# EAGLE design fenrir (EAGLE 9.6.2)
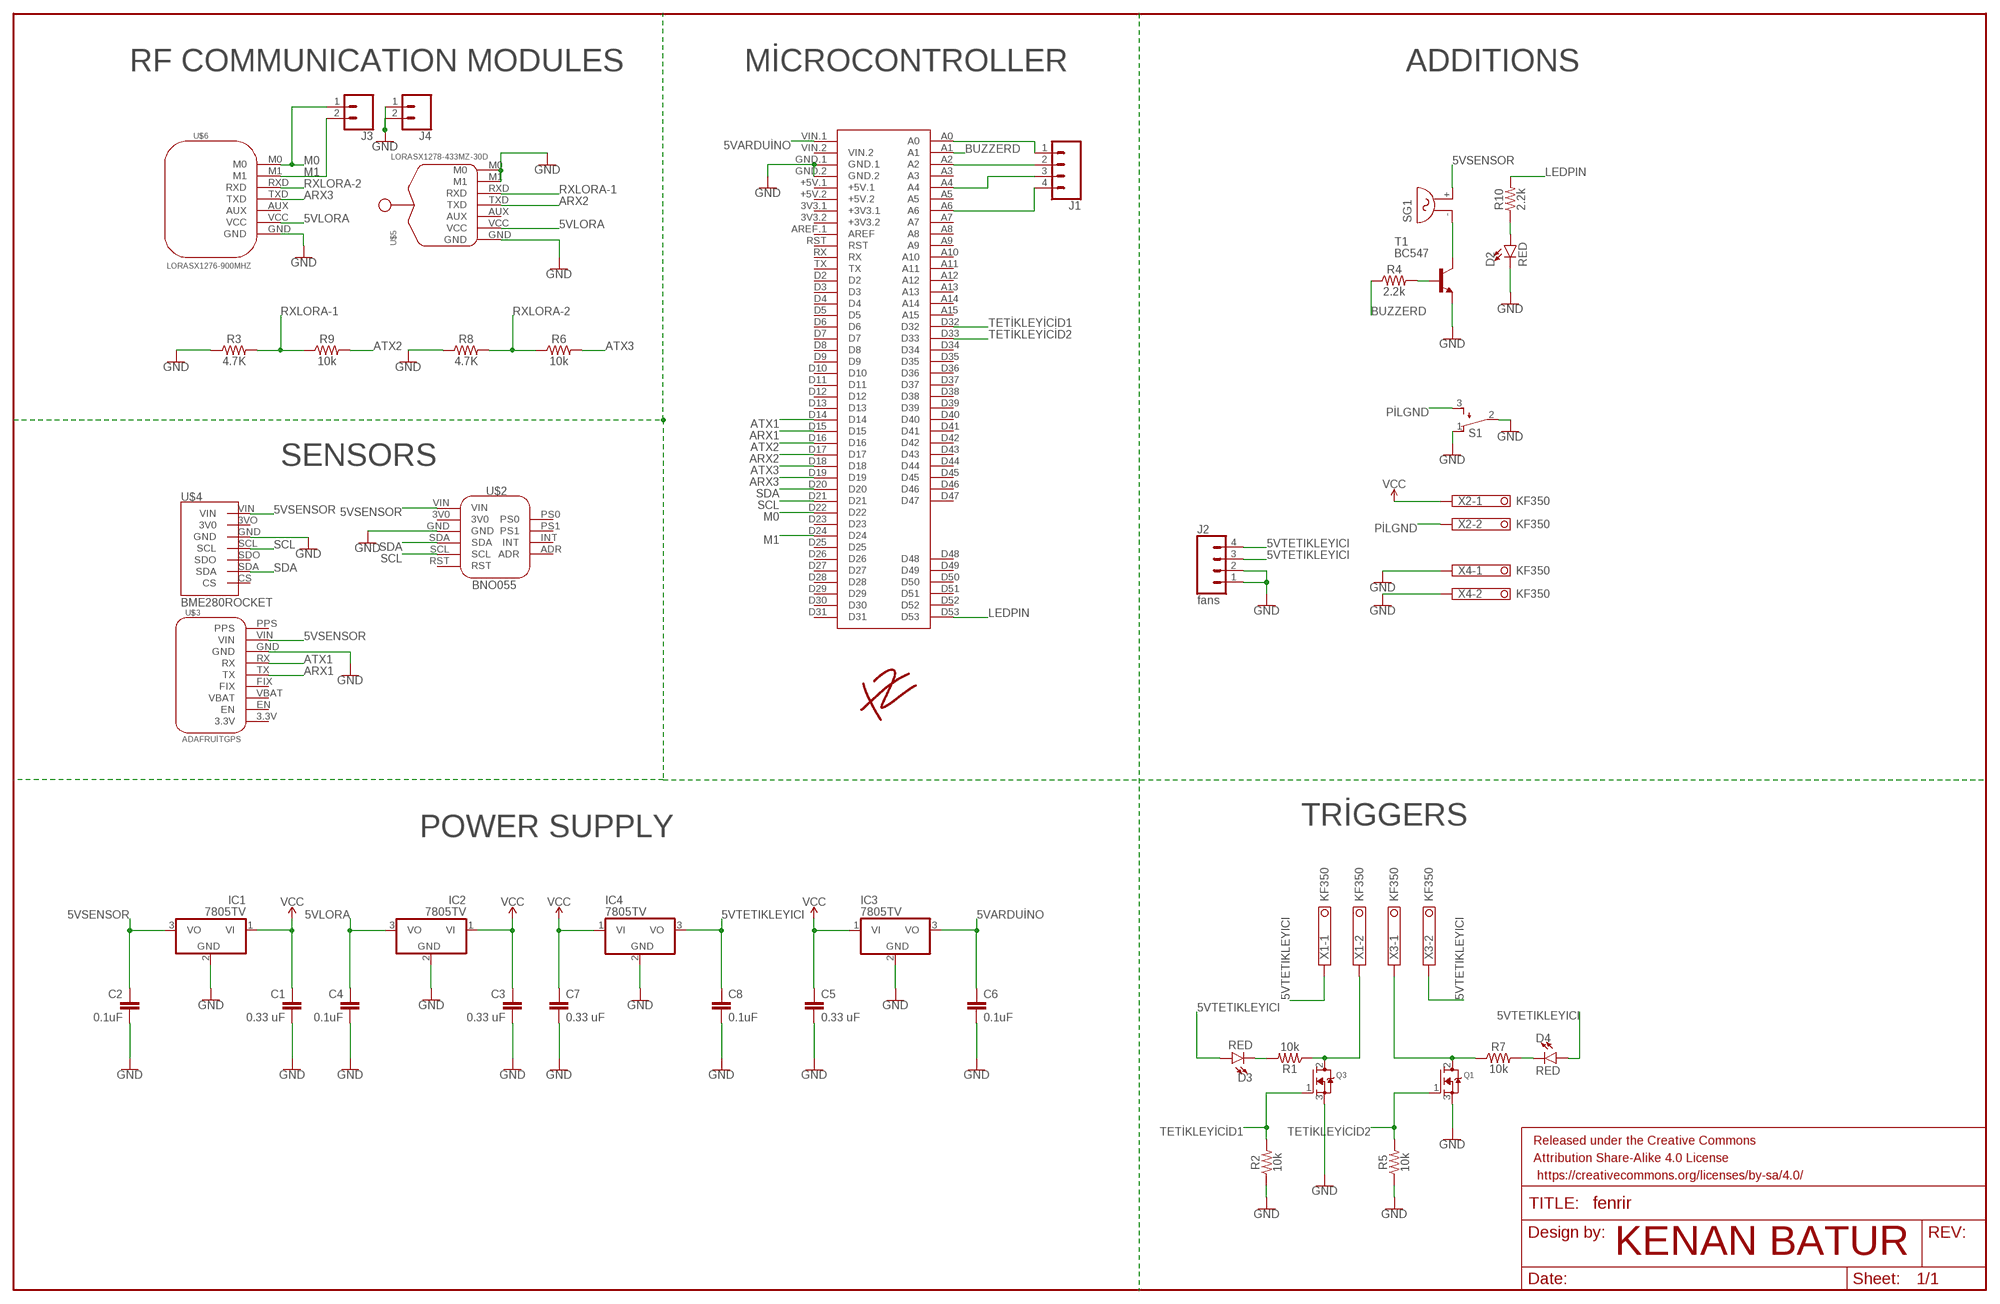
[diagram p0: schematic, sheet 1]

## Parts
C1  0.33 uF  C2,5-3  [C2.5-3]
C2  0.1uF  C2,5-3  [C2.5-3]
C3  0.33 uF  C2,5-3  [C2.5-3]
C4  0.1uF  C2,5-3  [C2.5-3]
C5  0.33 uF  C2,5-3  [C2.5-3]
C6  0.1uF  C2,5-3  [C2.5-3]
C7  0.33 uF  C2,5-3  [C2.5-3]
C8  0.1uF  C2,5-3  [C2.5-3]
D2  RED  LED-RED1206  [LED-1206]
D3  RED  LED-RED1206  [LED-1206]
D4  RED  LED-RED1206  [LED-1206]
FRAME2  FRAME-LEDGER  [CREATIVE_COMMONS]
IC1  7805TV  [TO220V]
IC2  7805TV  [TO220V]
IC3  7805TV  [TO220V]
IC4  7805TV  [TO220V]
J1  CONN_04  [1X04]
J2  fans  CONN_04  [1X04]
J3  CONN_02  [1X02]
J4  CONN_02  [1X02]
Q1  MOSFET-NGDS_TO220V  [TO220V]
Q3  MOSFET-NGDS_TO220V  [TO220V]
R1  10k  10KOHM-HORIZ-1/4W-1%  [AXIAL-0.3]
R2  10k  10KOHM-HORIZ-1/4W-1%  [AXIAL-0.3]
R3  4.7K  10KOHM-HORIZ-1/4W-5%  [AXIAL-0.3]
R4  2.2k  10KOHM-HORIZ-1/4W-1%  [AXIAL-0.3]
R5  10k  10KOHM-HORIZ-1/4W-1%  [AXIAL-0.3]
R6  10k  10KOHM-HORIZ-1/4W-5%  [AXIAL-0.3]
R7  10k  10KOHM-HORIZ-1/4W-1%  [AXIAL-0.3]
R8  4.7K  10KOHM-HORIZ-1/4W-5%  [AXIAL-0.3]
R9  10k  10KOHM-HORIZ-1/4W-5%  [AXIAL-0.3]
R10  2.2k  10KOHM-HORIZ-1/4W-1%  [AXIAL-0.3]
S1  TL32PO  [TL3XPO]
SG1  F/QMX  [F/QMX]
T1  BC547  [TO92]
U$1  MEGA2560_MIKRO  [MEGA2560_MIKRO]
U$2  BNO055  [BNO055]
U$3  ADAFRUİTGPS  [ADAFRUİTGPS]
U$4  BME280ROCKET  [BME280ROCKET]
U$5  LORASX1278-433MZ-30D  [LORASX1278-433MHZ-30D]
U$6  LORASX1276-900MHZ  LORASX1278-433MHZ  [LORASX1278-433MHZ]
U$7  MAVİLOGO  [LOGOMAVİ]
X1  KF350  TERMINAL-BLOCK-3.5MM-2-PIN-ROUND-PAD  [TERMINAL-BLOCK-2-PIN-3.5MM-ROUND-PAD]
X2  KF350  TERMINAL-BLOCK-3.5MM-2-PIN-ROUND-PAD  [TERMINAL-BLOCK-2-PIN-3.5MM-ROUND-PAD]
X3  KF350  TERMINAL-BLOCK-3.5MM-2-PIN-ROUND-PAD  [TERMINAL-BLOCK-2-PIN-3.5MM-ROUND-PAD]
X4  KF350  TERMINAL-BLOCK-3.5MM-2-PIN-ROUND-PAD  [TERMINAL-BLOCK-2-PIN-3.5MM-ROUND-PAD]

## Nets
5VARDUİNO: C6.1 IC3.3(VO) U$1.VIN.1
5VLORA: C4.1 IC2.3(VO) U$5.VCC U$6.VCC
5VSENSOR: C2.1 IC1.3(VO) SG1.+ U$2.VIN U$3.VIN U$4.VIN
5VTETIKLEYICI: C8.1 D3.A D4.A IC4.3(VO) J2.3 J2.4 X1.1 X3.2
ARX1: U$1.D15 U$3.TX
ARX2: U$1.D17 U$5.TXD
ARX3: U$1.D19 U$6.TXD
ATX1: U$1.D14 U$3.RX
ATX2: R9.P$2 U$1.D16
ATX3: R6.P$2 U$1.D18
BUZZERD: R4.P$1 U$1.A1
GND: C1.2 C2.2 C3.2 C4.2 C5.2 C6.2 C7.2 C8.2 D2.C IC1.2(GND) IC2.2(GND) IC3.2(GND) IC4.2(GND) J2.1 J2.2 J4.1 J4.2 Q1.3(S) Q3.3(S) R2.P$1 R3.P$1 R5.P$1 R8.P$1 S1.1(O) S1.2(P) T1.1(E) U$1.GND.1 U$1.GND.2 U$2.GND U$3.GND U$4.GND U$5.GND U$5.M0 U$5.M1 U$6.GND X4.1 X4.2
LEDPIN: R10.P$2 U$1.D53
M0: J3.1 U$1.D22 U$6.M0
M1: J3.2 U$1.D24 U$6.M1
N$1: Q3.2(D) R1.P$1 X1.2
N$2: SG1.- T1.3(C)
N$3: J1.1 U$1.A0
N$4: D3.C R1.P$2
N$5: D4.C R7.P$2
N$6: Q1.2(D) R7.P$1 X3.1
N$7: R4.P$2 T1.2(B)
N$8: J1.2 U$1.A2
N$9: J1.3 U$1.A4
N$10: J1.4 U$1.A6
N$11: D2.A R10.P$1
PİLGND: S1.3(S) X2.2
RXLORA-1: R3.P$2 R9.P$1 U$5.RXD
RXLORA-2: R6.P$1 R8.P$2 U$6.RXD
SCL: U$1.D21 U$2.SCL U$4.SCL
SDA: U$1.D20 U$2.SDA U$4.SDA
TETİKLEYİCİD1: Q3.1(G) R2.P$2 U$1.D32
TETİKLEYİCİD2: Q1.1(G) R5.P$2 U$1.D33
VCC: C1.1 C3.1 C5.1 C7.1 IC1.1(VI) IC2.1(VI) IC3.1(VI) IC4.1(VI) X2.1
Unconnected: U$1.3V3.1(+3V3.1) U$1.3V3.2(+3V3.2) U$1.+5V.1 U$1.+5V.2 U$1.A3 U$1.A5 U$1.A7 U$1.A8 U$1.A9 U$1.A10 U$1.A11 U$1.A12 U$1.A13 U$1.A14 U$1.A15 U$1.AREF.1(AREF) U$1.D2 U$1.D3 U$1.D4 U$1.D5 U$1.D6 U$1.D7 U$1.D8 U$1.D9 U$1.D10 U$1.D11 U$1.D12 U$1.D13 U$1.D23 U$1.D25 U$1.D26 U$1.D27 U$1.D28 U$1.D29 U$1.D30 U$1.D31 U$1.D34 U$1.D35 U$1.D36 U$1.D37 U$1.D38 U$1.D39 U$1.D40 U$1.D41 U$1.D42 U$1.D43 U$1.D44 U$1.D45 U$1.D46 U$1.D47 U$1.D48 U$1.D49 U$1.D50 U$1.D51 U$1.D52 U$1.RST U$1.RX U$1.TX U$1.VIN.2 U$2.3V0 U$2.ADR U$2.INT U$2.PS0 U$2.PS1 U$2.RST U$3.3.3V U$3.EN U$3.FIX U$3.PPS U$3.VBAT U$4.3VO(3V0) U$4.CS U$4.SDO U$5.AUX U$6.AUX

## Notes on the sheet
- RF COMMUNICATION MODULES | MİCROCONTROLLER | ADDITIONS
- SENSORS
- TRİGGERS
- POWER SUPPLY
- KENAN BATUR

## Library data of the parts
C1-C8 = capacitor-wima:C: CAPACITOR naming: grid - package width
D2-D4 = SparkFun-LED:LED-RED: Red SMD LED Used in manufacturing of most products at SparkFun Packages: 0603 - SMD 0603 package [Product Link] <http://docs.avagotech.com/docs/AV02-0551EN> 0603 SMART - SMD 0603 SMART package ( more efficient and expensive)[Product Link] <http://www.osram-os.com/Graphics/XPic2/00077099_0.pdf> 1206 - SMD1206 package [Product Link] <https://www.sparkfun.com/datasheets/DevTools/LilyPad/Q150OVS4.pdff> SparkFun Products: Pro Mini 328 -5V <https://www.sparkfun.com/products/821> RedBoard <https://www.sparkfun.com/products/12757> IOIO-OTG <https://www.sparkfun.com/products/13613>; PROD_ID: DIO-09912
FRAME2 = SparkFun-Aesthetics:FRAME-LEDGER: Schematic Frame - Ledger Standard 11x14 US Ledger frame; DESIGN: asd
IC1-IC4 = linear:78*: Positive VOLTAGE REGULATOR Source: http://cache.national.com/ds/LM/LM78L05.pdf http://www.fairchildsemi.com/ds/LM/LM7805.pdf
J1 J2 = SparkFun-Connectors:CONN_04: Multi connection point. Often used as Generic Header-pin footprint for 0.1 inch spaced/style header connections On any of the 0.1 inch spaced packages, you can populate with these: Break Away Headers - Straight <https://www.sparkfun.com/products/116> (PRT-00116) Break Away Male Headers - Right Angle <https://www.sparkfun.com/products/553> (PRT-00553) Female Headers <https://www.sparkfun.com/products/115> (PRT-00115) Break Away Headers - Machine Pin <https://www.sparkfun.com/products/117> (PRT-00117) Break Away Female Headers - Swiss Machine Pin <https://www.sparkfun.com/products/743> (PRT-00743) For SCREWTERMINALS and SPRING TERMINALS visit here: Screw Terimnals on SparkFun.com <https://www.sparkfun.com/search/results?term=Screw+Terminals> (5mm/3.5mm/2.54mm spacing) This device is also useful as a general connection point to wire up your design to another part of your project. Our various solder wires solder well into these plated through hole pads. Hook-Up Wire - Assortment (Stranded, 22 AWG) <https://www.sparkfun.com/products/11375> (PRT-11375) Hook-Up Wire - Assortment (Solid Core, 22 AWG) <https://www.sparkfun.com/products/11367> (PRT-11367) View the entire wire category on our website here <https://www.sparkfun.com/categories/141> Special notes: Molex polarized connector foot print use with SKU : PRT-08231 with associated crimp pins and housings. 1MM SMD Version SKU: PRT-10208; PROD_ID: CONN-09696
J3 J4 = SparkFun-Connectors:CONN_02: Multi connection point. Often used as Generic Header-pin footprint for 0.1 inch spaced/style header connections On any of the 0.1 inch spaced packages, you can populate with these: Break Away Headers - Straight <https://www.sparkfun.com/products/116> (PRT-00116) Break Away Male Headers - Right Angle <https://www.sparkfun.com/products/553> (PRT-00553) Female Headers <https://www.sparkfun.com/products/115> (PRT-00115) Break Away Headers - Machine Pin <https://www.sparkfun.com/products/117> (PRT-00117) Break Away Female Headers - Swiss Machine Pin <https://www.sparkfun.com/products/743> (PRT-00743) For SCREWTERMINALS and SPRING TERMINALS visit here: Screw Terimnals on SparkFun.com <https://www.sparkfun.com/search/results?term=Screw+Terminals> (5mm/3.5mm/2.54mm spacing) This device is also useful as a general connection point to wire up your design to another part of your project. Our various solder wires solder well into these plated through hole pads. Hook-Up Wire - Assortment (Stranded, 22 AWG) <https://www.sparkfun.com/products/11375> (PRT-11375) Hook-Up Wire - Assortment (Solid Core, 22 AWG) <https://www.sparkfun.com/products/11367> (PRT-11367) View the entire wire category on our website here <https://www.sparkfun.com/categories/141> Special notes: Molex polarized connector foot print use with: PRT-08233 with associated crimp pins and housings. 2.54_SCREWTERM for use with PRT-10571. 3.5mm Screw Terminal footprints for PRT-08084 5mm Screw Terminal footprints for use with PRT-08432
Q1 Q3 = adafruit:MOSFET-N: N-Channel Mosfet 2N7002E - 60V 260mA SOT23 [Digikey: 2N7002ET1GOSTR-ND] - REEL BSH103 - 30V 850mA SOT23 [Digikey: 568-5013-1-ND]
R1 R2 R5 R7 = SparkFun-Resistors:10KOHM: 10kΩ resistor A resistor is a passive two-terminal electrical component that implements electrical resistance as a circuit element. Resistors act to reduce current flow, and, at the same time, act to lower voltage levels within circuits. - Wikipedia; PROD_ID: RES-12183
R3 R8 = SparkFun-Resistors:10KOHM: 10kΩ resistor A resistor is a passive two-terminal electrical component that implements electrical resistance as a circuit element. Resistors act to reduce current flow, and, at the same time, act to lower voltage levels within circuits. - Wikipedia; PROD_ID: RES-09435; VALUE: 10k
R4 R10 = SparkFun-Resistors:10KOHM: 10kΩ resistor A resistor is a passive two-terminal electrical component that implements electrical resistance as a circuit element. Resistors act to reduce current flow, and, at the same time, act to lower voltage levels within circuits. - Wikipedia; PROD_ID: RES-12183; VALUE: 10k
R6 R9 = SparkFun-Resistors:10KOHM: 10kΩ resistor A resistor is a passive two-terminal electrical component that implements electrical resistance as a circuit element. Resistors act to reduce current flow, and, at the same time, act to lower voltage levels within circuits. - Wikipedia; PROD_ID: RES-09435
S1 = switch:TL32PO: TINY SWITCH ON - MOM Source: http://www2.produktinfo.conrad.com/datenblaetter/700000-724999/705152-da-01-de-Subminiaturschalter_TL_36YO.pdf
SG1 = buzzer:F/QMX: BUZZER Source: Buerklin; OC_FARNELL: unknown; OC_NEWARK: unknown
T1 = transistor:BC547: NPN TRANSISTOR
U$1 = MIKRO_MEGA2560:MEGA2560_MIKRO: Arduino Mega2560 pro robotDyn, create by mikroavr.com
U$2 = BNO055:BNO055
U$3 = Adafruitgps:ADAFRUİTGPS
U$4 = BME280ROCKET:BME280ROCKET
U$5 = LORASX1278-433MHZ20D:LORASX1278-433MZ-30D
U$6 = LORASX1278-433MHZ20D:LORASX1278-433MHZ
U$7 = LOGO:MAVİLOGO
X1-X4 = Rembrandt Electronics - Terminal Block 3-5mm v1-0:TERMINAL-BLOCK-3.5MM-2-PIN: Terminal Block 3.5mm Pitch: 3,5 mm Number of pins: 2 Created by Rembrandt Electronics www.rembrandtelectronics.com

## Board
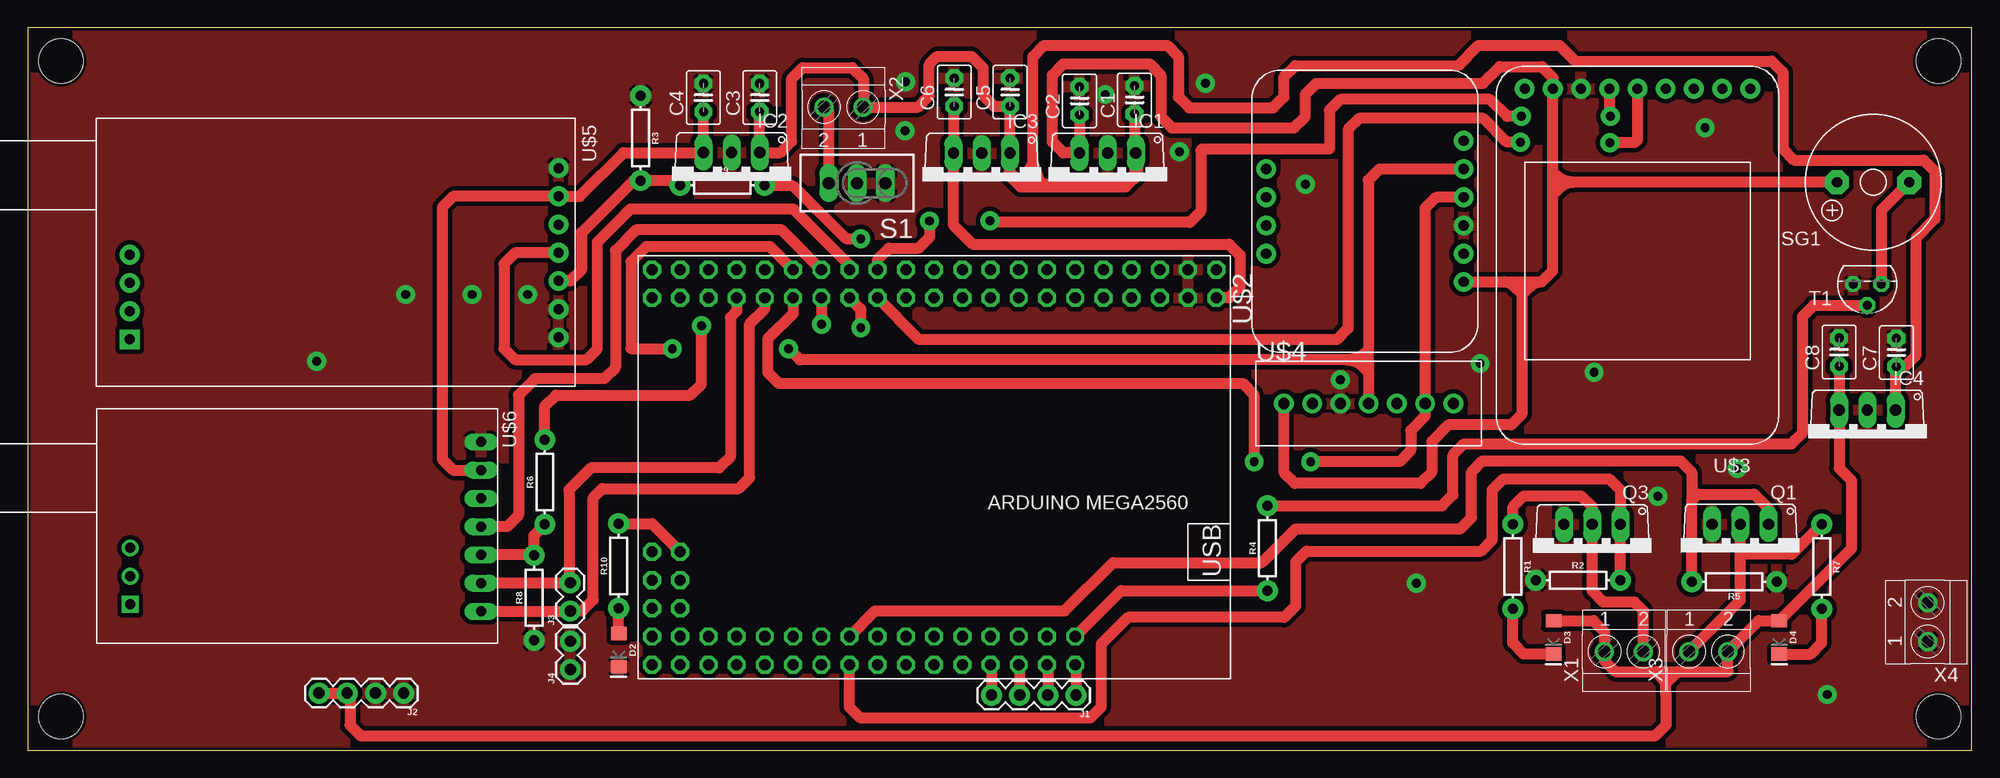
[diagram p1: board, top side]
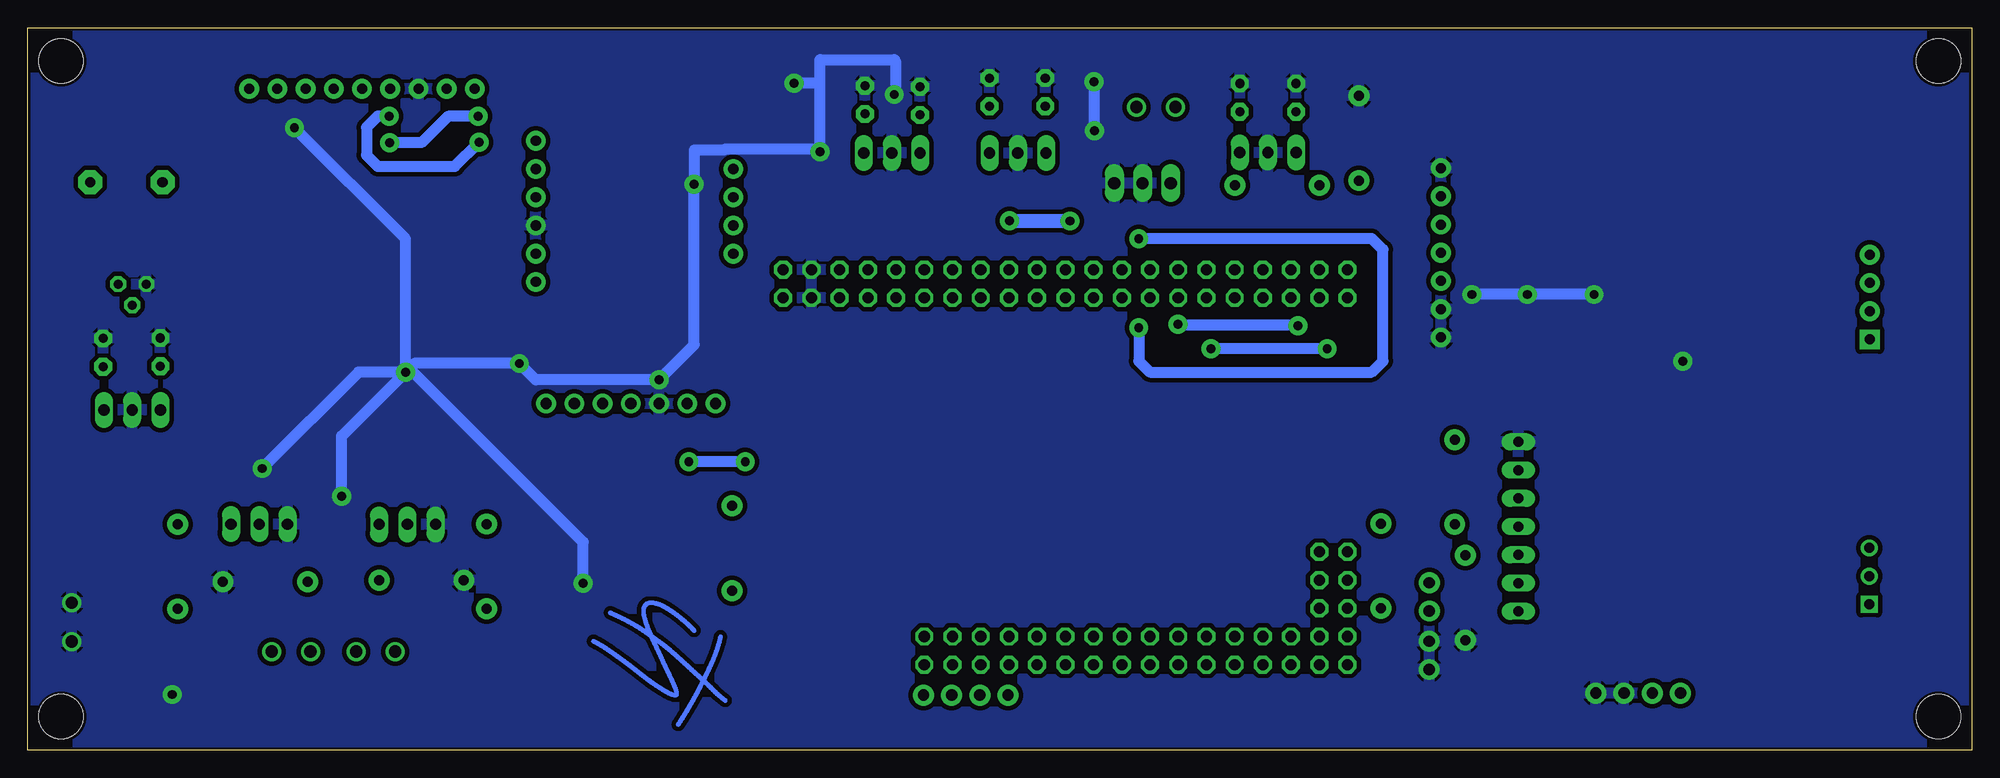
[diagram p2: board, bottom side, seen from below]

Size 175 x 65 mm. Coordinates in mm from the lower left corner, seen from the top.
Outline: 0,0 175,0 175,65 0,65 0,0
Copper layers (1*16): Top 0.035mm / dielectric 1.5mm / Bottom 0.035mm
Design rules "SparkFun *": minimum track width 8mil, minimum drill 20mil, track to track 16mil, track to pad 16mil, pad to pad 8mil, via to via 8mil, smd to smd 8mil, copper to edge 10mil, drill to drill 8mil, minimum pad ring 12mil, minimum via ring 10mil, stop-mask expansion 4mil, vias tented up to drill 25mil, thermal gap 10mil
Holes 4 mm at 3,62 3,3 172,62 172,3

### Footprints (pad centres in the part's own frame; a part is rotated, then mirrored left to right if it is on the bottom)
C2.5-3 = drill 0.813 pad 1.6 octagon: 1 -1.27,0; 2 1.27,0
LED-1206 = smd 1.2 x 1.4: A -1.5,0; C 1.5,0
TO220V = drill 1.016 long: 1 -2.54,-2.54; 2 0,-2.54; 3 2.54,-2.54
1X04 = drill 1.016 pad 1.88: 1 0,0; 2 2.54,0; 3 5.08,0; 4 7.62,0
1X02 = drill 1.016 pad 1.88: 1 0,0; 2 2.54,0
AXIAL-0.3 = drill 0.9 pad 1.88: P$1 -3.81,0; P$2 3.81,0
TL3XPO = drill 1.1 pad 1.422 long: 1 -2.54,0; 2 0,0; 3 2.54,0
F/QMX = drill 0.914 pad 2.159 octagon: + 3.251,0; - -3.251,0
TO92 = drill 0.813 octagon: 1 1.27,0; 2 0,1.905; 3 -1.27,0
MEGA2560_MIKRO = drill 1 octagon: 3V3.1 -26.67,-17.78; 3V3.2 -26.67,-20.32; +5V.1 -29.21,-17.78; +5V.2 -29.21,-20.32; A0 -21.59,15.24; A1 -21.59,12.7; A2 -19.05,15.24; A3 -19.05,12.7; A4 -16.51,15.24; A5 -16.51,12.7; A6 -13.97,15.24; A7 -13.97,12.7; A8 -11.43,15.24; A9 -11.43,12.7; A10 -8.89,15.24; A11 -8.89,12.7; A12 -6.35,15.24; A13 -6.35,12.7; A14 -3.81,15.24; A15 -3.81,12.7; AREF.1 -24.13,-17.78; D2 -19.05,-17.78; D3 -19.05,-20.32; D4 -16.51,-17.78; D5 -16.51,-20.32; D6 -13.97,-17.78; D7 -13.97,-20.32; D8 -11.43,-17.78; D9 -11.43,-20.32; D10 -8.89,-17.78; D11 -8.89,-20.32; D12 -6.35,-17.78; D13 -6.35,-20.32; D14 -3.81,-17.78; D15 -3.81,-20.32; D16 -1.27,-17.78; D17 -1.27,-20.32; D18 1.27,-17.78; D19 1.27,-20.32; D20 3.81,-17.78; D21 3.81,-20.32; D22 6.35,-17.78; D23 6.35,-20.32; D24 8.89,-17.78; D25 8.89,-20.32; D26 11.43,-17.78; D27 11.43,-20.32; D28 13.97,-17.78; D29 13.97,-20.32; D30 16.51,-17.78; D31 16.51,-20.32; D32 -1.27,15.24; D33 -1.27,12.7; D34 1.27,15.24; D35 1.27,12.7; D36 3.81,15.24; D37 3.81,12.7; D38 6.35,15.24; D39 6.35,12.7; D40 8.89,15.24; D41 8.89,12.7; D42 11.43,15.24; D43 11.43,12.7; D44 13.97,15.24; D45 13.97,12.7; D46 16.51,15.24; D47 16.51,12.7; D48 16.51,10.16; D49 13.97,10.16; D50 16.51,7.62; D51 13.97,7.62; D52 16.51,5.08; D53 13.97,5.08; GND.1 -31.75,-17.78; GND.2 -31.75,-20.32; RST -24.13,-20.32; RX -21.59,-17.78; TX -21.59,-20.32; VIN.1 -34.29,-17.78; VIN.2 -34.29,-20.32
BNO055 = drill 0.914 pad 1.778: 3V0 8.89,-19.05; ADR 16.51,-1.27; GND 11.43,-19.05; INT 13.97,-1.27; PS0 8.89,-1.27; PS1 11.43,-1.27; RST 19.05,-19.05; SCL 16.51,-19.05; SDA 13.97,-19.05; VIN 6.35,-19.05
ADAFRUİTGPS = drill 0.9 pad 1.778: 3.3V 2.54,-32.004; EN 5.08,-32.004; FIX 10.16,-32.004; GND 17.78,-32.004; PPS 22.86,-32.004; RX 15.24,-32.004; TX 12.7,-32.004; VBAT 7.62,-32.004; VIN 20.32,-32.004
BME280ROCKET = drill 1 pad 1.778: 3VO 2.54,0; CS 15.24,0; GND 5.08,0; SCL 7.62,0; SDA 12.7,0; SDO 10.16,0; VIN 0,0
LORASX1278-433MHZ-30D = drill 0.9 pad 1.778: AUX -2.475,2.31; GND -7.555,2.31; M0 7.685,2.31; M1 5.145,2.31; P$9 5.325,-36.29; P$10 2.785,-36.29; P$11 0.245,-36.29; RXD 2.605,2.31; TXD 0.065,2.31; VCC -5.015,2.31 | drill 0.9 pad 1.778 square: P$8 7.865,-36.29
LORASX1278-433MHZ = drill 0.9 long: AUX -2.54,0; GND -7.62,0; M0 7.62,0; M1 5.08,0; RXD 2.54,0; TXD 0,0; VCC -5.08,0 | drill 0.9 square: P$18 7,-31.6 | drill 0.9: P$19 4.46,-31.6; P$20 1.92,-31.6
TERMINAL-BLOCK-2-PIN-3.5MM-ROUND-PAD = drill 1.1 pad 1.7: 1 -1.75,-0.1; 2 1.75,-0.1

### Placement (x,y rotation side)
C1  99.64,58.51 90 top
C2  94.68,58.43 90 top
C3  65.9,58.72 90 top
C4  60.82,58.72 90 top
C5  88.43,59.21 90 top
C6  83.4,59.21 90 top
C7  168.22,35.77 90 top
C8  163.06,35.81 90 top
D2  53.2,8.99 270 top
D3  137.35,10.14 270 top
D4  157.67,10.14 270 top
FRAME2  1,75 0 top  (outside the outline)
IC1  97.21,51.2 180 top
IC2  63.36,51.22 180 top
IC3  85.87,51.18 180 top
IC4  165.61,28.06 180 top
J1  94.37,4.94 180 top
J2  33.84,5.12 180 top
J3  48.83,12.51 90 top
J4  48.84,7.25 90 top
Q1  154.16,17.78 180 top
Q3  140.83,17.77 180 top
R1  133.69,16.53 270 top
R2  139.55,15.28 0 top
R3  55.17,55.06 270 top
R4  111.6,18.16 90 top
R5  153.62,15.14 180 top
R6  46.55,24.11 90 top
R7  161.49,16.5 270 top
R8  45.57,13.7 90 top
R9  62.53,50.84 0 top
R10  53.2,16.57 90 top
S1  74.65,51.02 180 top
SG1  166.12,51.11 180 top
T1  165.59,41.94 180 top
U$1  72.7,22.91 180 top
U$2  110.21,35.78 90 top
U$3  157.61,27.5 180 top
U$4  113.09,31.18 0 top
U$5  45.47,44.82 270 top
U$6  40.82,20.11 270 top
U$7  117.1,8.26 0 top
X1  143.69,8.96 0 top
X2  73.44,57.77 180 top
X3  151.3,8.96 0 top
X4  170.93,11.51 90 top

### Tracks (layer width: path | path; a pad name or v marks a point on that pad's centre or on a via)
5VARDUİNO
  Top 1: U$1.VIN.1 108.14,40.69 109.14,41.69 109.14,44.53 108.14,45.53 85.05,45.53 83.3,47.28 83.3,53.69 IC3.3 83.4,53.8 C6.1 | U$1.VIN.1
5VLORA
  Top 1: C4.1 IC2.3 53.63,53.76 49.7,49.83 U$5.VCC 38.3,49.83 37.3,48.83 37.3,26.19 38.3,25.19 U$6.VCC
5VSENSOR
  Top 1: U$2.VIN 132.86,42.13 | 132.86,42.13 134.54,42.13 | 134.54,42.13 136.29,42.13 | 136.29,42.13 137.29,43.13 137.29,50 | 137.29,50 137.29,51.36 | 137.29,51.36 137.29,52 | 137.29,52 U$3.VIN 137.31,59.53 137.31,60.5 136.31,61.5 132.5,61.5 131,60 116,60 115,59 115,57 114,56 103,56 102,57 102,60.74 101,61.74 93.23,61.74 92.23,60.74 92.23,54.74 93.23,53.74 IC1.3 94.68,53.75 C2.1 | 134.54,42.13 134.54,41 | 134.54,41 134.54,30.27 133.54,29.27 127.9,29.27 126.39,27.76 126.39,24.99 125.39,23.99 114.07,23.99 113.09,24.97 U$4.VIN | SG1.+ 139.23,51.11 | 139.23,51.11 137.54,51.11 137.29,51.36 | 137.29,52 137.43,51.86 arc45 139.23,51.11 | 137.29,50 137.82,50.53 arc-45 139.23,51.11 | 134.54,41 135.23,41.69 arc-45 136.29,42.13 | 134.54,41 133.8,41.74 arc45 132.86,42.13
5VTETIKLEYICI
  Top 1: 146.63,7.05 142.94,7.05 141.94,8.05 X1.1 141.94,10.64 140.94,11.64 D3.A | 146.63,7.05 147.22,7.05 | 147.22,7.05 148.53,7.05 | 148.53,7.05 153.05,7.05 X3.2 155.83,11.64 D4.A 164.16,18.13 164.16,24.28 163.07,25.37 IC4.3 163.06,30.61 C8.1 | 147.22,7.05 147.48,6.78 147.47,6.77 147.47,6 | J2.4 J2.3 29,4.88 29,2.24 30,1.24 146.47,1.24 147.47,2.24 147.47,4.99 147.47,6 | 147.47,6 | 147.47,6 146.63,7.05 | 147.47,6 148.53,7.05
ARX1  (via drill 0.8 pad 1.7)
  Top 1: U$3.TX 144.91,54.9 144.66,54.65 v142.43,54.65 | v86.61,47.64 86.76,47.49 104.6,47.49 105.6,48.49 105.6,53.97 105.72,54.08 117.17,54.08 117.17,57.56 118.17,58.56 131.64,58.56 133.18,57.02 v134.47,57.02 | v81.17,47.61 81.17,46.13 80.2,45.16 77.51,45.16 76.51,44.16 U$1.D15
  Bottom 1: v134.47,57.02 137.18,57.02 139.55,54.65 v142.43,54.65
  Bottom 1.27: v86.61,47.64 81.2,47.64 v81.17,47.61
ARX2
  Top 1: U$5.TXD 43.87,44.75 42.87,43.75 42.87,36.12 43.87,35.12 50.29,35.12 51.29,36.12 51.29,45.72 54.26,48.69 68.9,48.69 74.03,43.56 74.03,43.28 U$1.D17
ARX3
  Top 1: U$6.TXD 43.17,20.11 44.17,21.11 44.17,31.93 45.66,33.42 51.9,33.42 52.9,34.42 52.9,44.94 54.77,46.81 67.86,46.81 U$1.D19
ATX1  (via drill 0.8 pad 1.7)
  Top 1: U$3.RX 142.37,57.14 v142.47,57.04 | v134.38,54.71 133.17,54.71 131.03,56.85 119.86,56.85 118.86,55.85 118.86,37.94 117.86,36.94 80.25,36.94 U$1.D14
  Bottom 1: v142.47,57.04 143.5,57.04 144.5,56.04 144.5,53.53 143.5,52.53 136.57,52.53 v134.38,54.71
ATX2  (via drill 0.8 pad 1.7)
  Top 1: U$1.D16 74.99,39.68 v74.99,38 | v74.99,46.03 73.65,46.03 68.89,50.78 66.4,50.78 R9.P$2
  Bottom 1: v74.99,38 74.99,35 73.99,34 54,34 53,35 53,45.03 54,46.03 v74.99,46.03
ATX3  (via drill 0.8 pad 1.7)
  Top 1: U$1.D18 71.46,40.66 v71.46,38.33 | R6.P$2 46.55,30.94 47.55,31.94 59.64,31.94 60.64,32.94 v60.64,38.19
  Bottom 1: v60.64,38.19 60.71,38.26 71.39,38.26 v71.46,38.33
BUZZERD
  Top 1: U$1.A1 98.43,14.35 R4.P$1
GND  (via drill 0.8 pad 1.7)
  Bottom 1: v34,41 v40,41 v45,41 | v78.97,55.75 78.97,60.09 v79.01,60.13 | 103.69,60 v103.69,53.85 103.92,54.08 112.22,54.08 112.31,54 115,54 115.01,53.99 v115.01,50.92 115.01,36.47 v118.17,33.31 129.26,33.31 v130.75,34.79 140.21,34.79 140.65,34.36 | 103.69,60 103.69,62.1 103.67,62.13 96.99,62.13 96.89,62.03 96.89,59.11 v97,59 | 103.69,60 103.7,60.01 v106.02,60.01 | v141,34 141,46 v151,56 | 140.65,34.36 v141,34 | v141,34 145.22,34 v153.88,25.34 | v146.75,22.85 146.75,28.26 v141,34 | v125,15 125,18.71 140.65,34.36
  other vias: 26,35 162,5
  pour Top: -2,66 -2,-2 185,-2 185,66
  pour Bottom: -2,66 -2,-2 185,-2 185,66
LEDPIN
  Top 1: R10.P$2 56.18,20.38 U$1.D53
M0
  Top 1: U$6.M0 48.81,12.49 J3.1 49.91,12.51 50.91,13.51 50.91,22.72 51.71,23.52 63.98,23.52 64.98,24.52 64.98,38.36 66.35,39.73 U$1.D22
M1
  Top 1: U$6.M1 40.84,15.05 J3.2 48.73,15.16 48.73,23.4 50.7,25.38 62.25,25.38 63.25,26.38 63.25,38.95 63.81,39.51 U$1.D24
N$1
  Top 1: X1.2 145.44,12.52 144.65,13.31 141.83,13.31 140.83,14.31 Q3.2 140.83,21.87 139.83,22.87 134.69,22.87 133.69,21.87 R1.P$1
N$2
  Top 1: SG1.- 166.86,48.6 T1.3
N$3
  Top 1: U$1.A0 94.37,7.59 J1.1
N$4
  Top 1: D3.C 134.68,8.64 133.68,9.64 133.68,12.7 R1.P$2
N$5
  Top 1: D4.C 160.5,8.64 161.5,9.64 161.5,12.68 R7.P$2
N$6
  Top 1: X3.1 154.16,13.47 154.16,17.6 | 154.16,17.6 Q1.2 | R7.P$1 158.79,17.6 154.16,17.6
N$7
  Top 1: T1.2 160.78,40.03 159.78,39.03 159.78,28.56 158.78,27.56 129.3,27.56 128.3,26.56 128.3,22.97 127.3,21.97 R4.P$2
N$8
  Top 1: U$1.A2 91.83,7.59 J1.2
N$9
  Top 1: U$1.A4 89.29,7.59 J1.3
N$10
  Top 1: U$1.A6 86.75,7.59 J1.4
N$11
  Top 1: D2.A R10.P$1
PİLGND
  Top 1: S1.3 72.11,57.44 X2.2
RXLORA-1
  Top 1: U$5.RXD 48.84,42.21 49.84,43.21 49.84,46.56 54.53,51.25 R3.P$2 58.3,51.25 R9.P$1
RXLORA-2
  Top 1: U$6.RXD 45.51,17.57 R8.P$2 45.57,19.32 R6.P$1
SCL  (via drill 0.8 pad 1.7)
  Top 1: U$2.SCL 121.68,52.29 120.68,51.29 120.68,36.01 | 120.68,35.12 120.68,36.01 | 120.68,35.12 120.68,34 | 120.68,34 120.68,31.21 U$4.SCL | 120.68,35.12 69.5,35.12 v68.5,36.12 | U$1.D21 66.82,45.31 55.67,45.31 54.3,43.94 54.3,36.12 v58.02,36.12 | 120.68,36.01 120.54,35.86 arc-45 118.75,35.12 arc-45 120.14,34.54 120.68,34
  Bottom 1: v58.02,36.12 v68.5,36.12
SDA  (via drill 0.8 pad 1.7)
  Top 1: U$2.SDA 126.77,49.75 125.79,48.77 U$4.SDA 125.79,30.04 124.5,28.75 124.5,26.96 123.5,25.96 v115.49,25.96 | U$1.D20 68.89,39.28 66.61,37 66.61,33.99 67.61,32.99 109.37,32.99 110.37,31.99 110.37,26 v110.41,25.96
  Bottom 1: v110.41,25.96 v115.49,25.96
TETİKLEYİCİD1
  Top 1: R2.P$2 143.37,15.29 Q3.1 143.37,23.41 142.37,24.41 132.85,24.41 131.85,23.41 131.85,18.91 130.85,17.91 115.12,17.91 114.12,16.91 114.12,12.94 113.12,11.94 99.04,11.94 96.63,9.53 96.63,3.86 95.63,2.86 74.97,2.86 73.97,3.86 U$1.D32
TETİKLEYİCİD2
  Top 1: R5.P$2 149.78,15.17 149.78,22.46 | 149.78,22.46 150.35,23.03 155.42,23.03 156.71,21.73 156.71,20.33 Q1.1 | 149.78,22.46 149.78,25.01 148.78,26.01 130.96,26.01 129.96,25.01 129.96,20.91 128.96,19.91 114.15,19.91 111.1,16.86 97.69,16.86 93.35,12.51 76.27,12.51 U$1.D33
VCC
  Top 1: C1.1 99.64,53.85 | 99.79,53.7 IC1.1 | C3.1 IC2.1 65.91,53.77 67.77,53.77 68.77,54.77 68.77,60.42 69.77,61.42 74.22,61.42 75.22,60.42 75.22,57.9 X2.1 80.14,57.87 81.14,58.87 81.14,61.71 81.86,62.44 84.96,62.44 86,61.4 86,58.94 87,57.94 C5.1 88.41,57.92 IC3.1 88.41,51.82 | 90.48,50.81 90.48,53 | 90.48,53 90.48,62.41 91.48,63.41 102.58,63.41 103.58,62.41 103.58,58.79 104.58,57.79 112.1,57.79 113.1,58.79 113.1,60.6 114.1,61.6 128.78,61.6 130.59,63.41 137.89,63.41 139.3,62 157,62 158,61 158,54.1 159,53.1 170.69,53.1 171.69,52.1 171.69,47.79 170,46.1 170,35.55 169,34.55 168.26,34.55 C7.1 168.15,34.43 IC4.1 | 90.48,53 90.5,52.94 | 90.5,52.94 91.23,50.81 | 90.5,52.94 89.46,50.81
  Top 1.27: IC1.1 99.64,53.85 | 88.41,51.82 89.42,50.81 89.46,50.81 90.48,50.81 91.23,50.81 98.79,50.81 99.79,51.81 99.79,53.7